# Altium project 28Pins_Project_v1I2.PrjPcb (part 1 of 3)
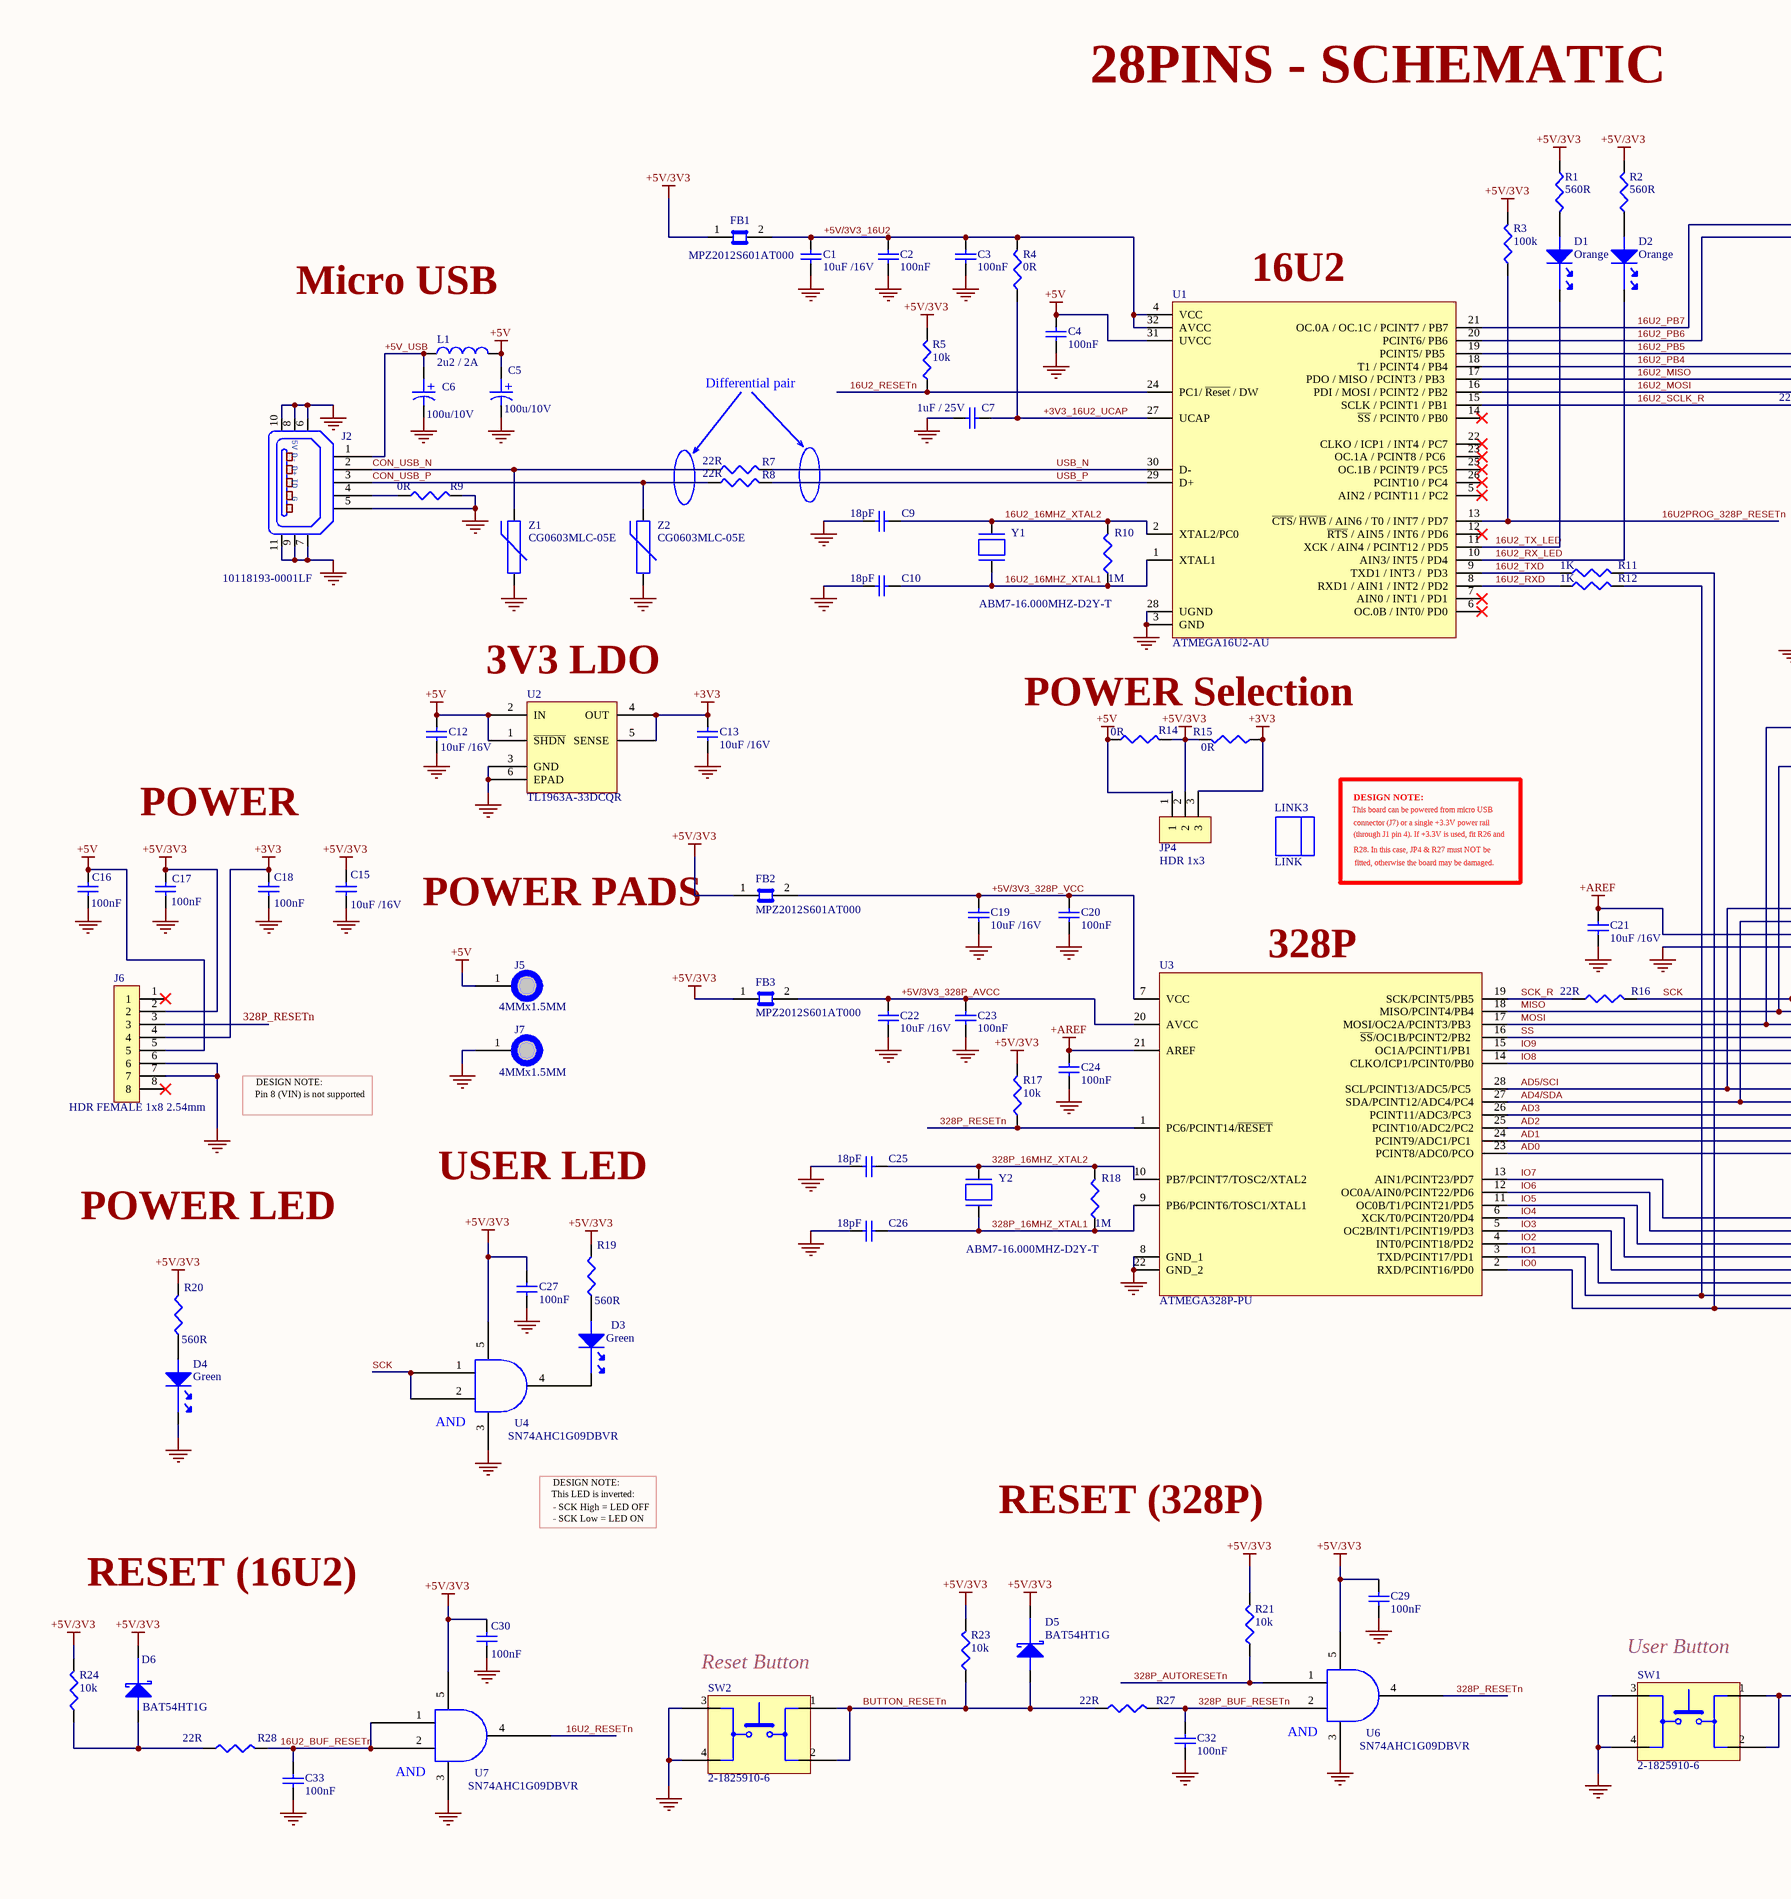
[diagram p0: 28Pins_Schem.SchDoc, left]
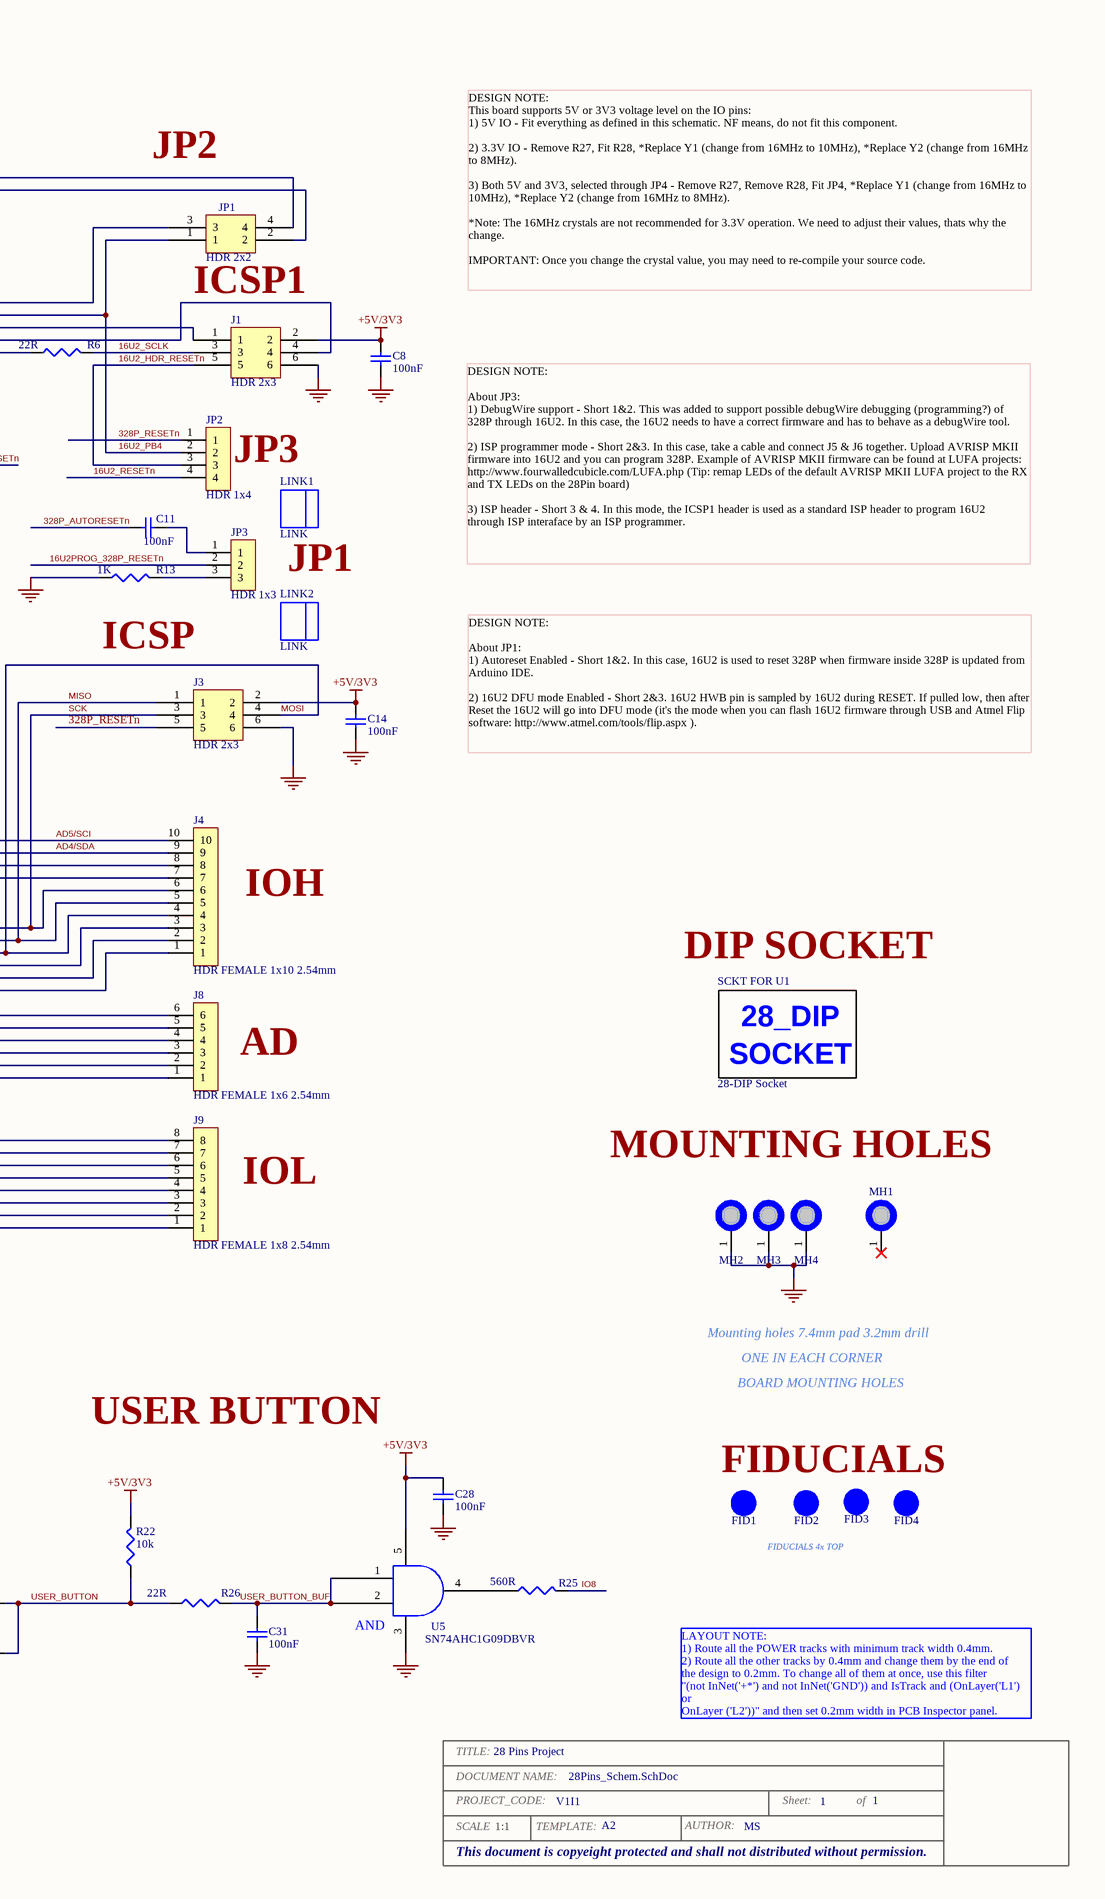
[diagram p1: 28Pins_Schem.SchDoc, right]
NotFitted: NF
1 sheet, 110 parts. Net scope: global (net labels, ports and power ports of the same name join across sheets).
Board file: 28Pins_Project_V1I1.PcbDoc

## Sheet 28Pins_Schem.SchDoc: 28 Pins Project
size A2; Author: MS; DocumentNumber: 1; Revision: V1I1; SheetNumber: 1; SheetTotal: 1

### Parts
28_Pins_Project  TEMPLATE: A2  (hidden comment: TitleBlock)  (graphical)
C1  10uF /16V  [C0805]
C2  100nF  [C0805]
C3  100nF  [C0805]
C4  100nF  [C0805]
C5  100u/10V  [C_ALU_C_SIZE]
C6  100u/10V  [C_ALU_C_SIZE]
C7  1uF / 25V  [C0805]
C8  100nF  [C0805]
C9  18pF  [C0805]
C10  18pF  [C0805]
C11  100nF  [C0805]
C12  10uF /16V  [C0805]
C13  10uF /16V  [C0805]
C14  100nF  [C0805]
C15  10uF /16V  [C0805]
C16  100nF  [C0805]
C17  100nF  [C0805]
C18  100nF  [C0805]
C19  10uF /16V  [C0805]
C20  100nF  [C0805]
C21  10uF /16V  [C0805]
C22  10uF /16V  [C0805]
C23  100nF  [C0805]
C24  100nF  [C0805]
C25  18pF  [C0805]
C26  18pF  [C0805]
C27  100nF  [C0805]
C28  100nF  [C0805]
C29  100nF  [C0805]
C30  100nF  [C0805]
C31  100nF  [C0805]
C32  100nF  [C0805]
C33  100nF  [C0805]
D1  Orange  [LED_0603]
D2  Orange  [LED_0603]
D3  Green  [LED_0603]
D4  Green  [LED_0603]
D5  BAT54HT1G  [SOD323]
D6  BAT54HT1G  [SOD323]
FB1  MPZ2012S601AT000  [C0805]
FB2  MPZ2012S601AT000  [C0805]
FB3  MPZ2012S601AT000  [C0805]
FID1  FID_1MMC  [FID_40X120]  (value not drawn)  (no BOM)
FID2  FID_1MMC  [FID_40X120]  (value not drawn)  (no BOM)
FID3  FID_1MMC  [FID_40X120]  (value not drawn)  (no BOM)
FID4  FID_1MMC  [FID_40X120]  (value not drawn)  (no BOM)
J1  HDR 2x3  [HDR_2x3_2.54MM]
J2  10118193-0001LF  [10118193]
J3  HDR 2x3  [HDR_2x3_2.54MM]
J4  HDR FEMALE 1x10 2.54mm  [Hdr_female_1x10_2.54mm]
J5  4MMx1.5MM  [PAD_WITH_HOLE_4MMx1.5MM]  (no BOM)
J6  HDR FEMALE 1x8 2.54mm  [Hdr_female_1x8_2.54mm]
J7  4MMx1.5MM  [PAD_WITH_HOLE_4MMx1.5MM]  (no BOM)
J8  HDR FEMALE 1x6 2.54mm  [Hdr_female_1x6_2.54mm]
J9  HDR FEMALE 1x8 2.54mm  [Hdr_female_1x8_2.54mm]
JP1  HDR 2x2  [HDR_2x2_2.54MM]
JP2  HDR 1x4  [Hdr_1x4_2.54mm]
JP3  HDR 1x3  [Hdr_1x3_2.54mm]
JP4  HDR 1x3  [Hdr_1x3_2.54mm]
L1  2u2 / 2A  [C1210_IND]
LINK1  LINK  (mechanical)
LINK2  LINK  (mechanical)
LINK3  LINK  (mechanical)
MH1  MH_7.4MMNC_3.2MMD  [MH_7.4MMD_3.2MMD_NON_COPPER_NPTH]  (value not drawn)  (no BOM)
MH2  MH_7.4MMC_3.2MMD  [MH_7.4MMD_3.2MMD]  (value not drawn)  (no BOM)
MH3  MH_7.4MMC_3.2MMD  [MH_7.4MMD_3.2MMD]  (value not drawn)  (no BOM)
MH4  MH_7.4MMC_3.2MMD  [MH_7.4MMD_3.2MMD]  (value not drawn)  (no BOM)
R1  560R  [R0805]
R2  560R  [R0805]
R3  100k  [R0805]
R4  0R  [R0805]
R5  10k  [R0805]
R6  22R  [R0805]
R7  22R  [R0805]
R8  22R  [R0805]
R9  0R  [R0805]
R10  1M  [R0805]
R11  1K  [R0805]
R12  1K  [R0805]
R13  1K  [R0805]
R14  0R  [R0805]
R15  0R  [R0805]
R16  22R  [R0805]
R17  10k  [R0805]
R18  1M  [R0805]
R19  560R  [R0805]
R20  560R  [R0805]
R21  10k  [R0805]
R22  10k  [R0805]
R23  10k  [R0805]
R24  10k  [R0805]
R25  560R  [R0805]
R26  22R  [R0805]
R27  22R  [R0805]
R28  22R  [R0805]
SCKT_FOR_U1  28-DIP Socket  [28_DIP_7.62mm_SOCKET]
SW1  2-1825910-6  [2-1825910-6]
SW2  2-1825910-6  [2-1825910-6]
U1  ATMEGA16U2-AU  [TQFP32]
U2  TL1963A-33DCQR  [DCQ (R-PDSO-G6)]
U3  ATMEGA328P-PU  [28_DIP_7.62MM]
U4  SN74AHC1G09DBVR  [DBV_SOT_23_5]
U5  SN74AHC1G09DBVR  [DBV_SOT_23_5]
U6  SN74AHC1G09DBVR  [DBV_SOT_23_5]
U7  SN74AHC1G09DBVR  [DBV_SOT_23_5]
Y1  ABM7-16.000MHZ-D2Y-T  [AMB7_V1_1_BIG]
Y2  ABM7-16.000MHZ-D2Y-T  [AMB7_V1_1_BIG]
Z1  CG0603MLC-05E  [R0603]
Z2  CG0603MLC-05E  [R0603]

### Nets
+3V3: C13.1 C18.1 J6.4 JP4.3 R15.1 U2.4(OUT) U2.5(SENSE)
+5V: C4.1 C5.1 C12.1 C16.1 J5.1 J6.5 JP4.1 L1.2 R14.1 U1.31(UVCC) U2.1(~{SHDN}) U2.2(IN)
+5V/3V3: C8.1 C14.1 C15.1 C17.1 C27.1 C28.1 C29.1 C30.1 D5.1(Cathode) D6.1(Cathode) FB1.1 FB2.1 FB3.1 J1.2 J3.2 J6.2 JP4.2 R1.1 R2.2 R3.2 R5.2 R14.2 R15.2 R17.2 R19.2 R20.2 R21.2 R22.2 R23.2 R24.2 U4.5 U5.5 U6.5 U7.5
+AREF: C21.1 C24.1 J4.8 U3.21(AREF)
GND: C1.2 C2.2 C3.2 C4.2 C5.2 C6.2 C7.1 C8.2 C9.1 C10.1 C12.2 C13.2 C14.2 C15.2 C16.2 C17.2 C18.2 C19.2 C20.2 C21.2 C22.2 C23.2 C24.2 C25.1 C26.1 C27.2 C28.2 C29.2 C30.2 C31.2 C32.2 C33.2 D4.1(Cathode) J1.6 J2.5 J2.6 J2.7 J2.8 J2.9 J2.10 J2.11 J3.6 J4.7 J6.6 J6.7 J7.1 MH2.1 MH3.1 MH4.1 R9.2 R13.1 SW1.3 SW1.4 SW2.3 SW2.4 U1.3(GND) U1.28(UGND) U2.3(GND) U2.6(EPAD) U3.8(GND_1) U3.22(GND_2) U4.3 U5.3 U6.3 U7.3 Z1.1 Z2.1
16U2_16MHZ_XTAL1: C10.2 R10.1 U1.1(XTAL1) Y1.1
16U2_16MHZ_XTAL2: C9.2 R10.2 U1.2(XTAL2/PC0) Y1.2
16U2_BUF_RESETn: C33.1 R28.2 U7.1 U7.2
16U2_HDR_RESETn: J1.5 JP2.3
16U2_MISO: J1.1 U1.17(PDO_/_MISO_/_PCINT3_/_PB3)
16U2_MOSI: J1.4 U1.16(PDI_/_MOSI_/_PCINT2_/_PB2)
16U2_PB4: JP1.1 JP2.2 U1.18(T1_/_PCINT4_/_PB4)
16U2_PB5: JP1.3 U1.19(PCINT5/_PB5)
16U2_PB6: JP1.2 U1.20(PCINT6/_PB6)
16U2_PB7: JP1.4 U1.21(OC.0A_/_OC.1C_/_PCINT7_/_PB7)
16U2_RESETn: JP2.4 R5.1 U1.24(PC1/_~{Reset}_/_DW) U7.4
16U2_RX_LED: D2.1(Cathode) U1.10(AIN3/_INT5_/_PD4)
16U2_RXD: R12.1 U1.8(RXD1_/_AIN1_/_INT2_/_PD2)
16U2_SCLK: J1.3 R6.2
16U2_SCLK_R: R6.1 U1.15(SCLK_/_PCINT1_/_PB1)
16U2_TX_LED: D1.1(Cathode) U1.11(XCK_/_AIN4_/_PCINT12_/_PD5)
16U2_TXD: R11.1 U1.9(TXD1_/_INT3_/__PD3)
16U2PROG_328P_RESETn: JP3.2 R3.1 U1.13(~{CTS}/_~{HWB}_/_AIN6_/_T0_/_INT7_/_PD7)
328P_16MHZ_XTAL1: C26.2 R18.1 U3.9(PB6/PCINT6/TOSC1/XTAL1) Y2.1
328P_16MHZ_XTAL2: C25.2 R18.2 U3.10(PB7/PCINT7/TOSC2/XTAL2) Y2.2
328P_AUTORESETn: C11.2 R21.1 U6.1
328P_BUF_RESETn: C32.1 R27.2 U6.2
328P_RESETn: J3.5 J6.3 JP2.1 R17.1 U3.1(PC6/PCINT14/~{RESET}) U6.4
+3V3_16U2_UCAP: C7.2 R4.1 U1.27(UCAP)
+5V/3V3_16U2: C1.1 C2.1 C3.1 FB1.2 R4.2 U1.4(VCC) U1.32(AVCC)
+5V/3V3_328P_AVCC: C22.1 C23.1 FB3.2 U3.20(AVCC)
+5V/3V3_328P_VCC: C19.1 C20.1 FB2.2 U3.7(VCC)
+5V_USB: C6.1 J2.1 L1.1
AD0: J8.1 U3.23(PCINT8/ADC0/PCO)
AD1: J8.2 U3.24(PCINT9/ADC1/PC1)
AD2: J8.3 U3.25(PCINT10/ADC2/PC2)
AD3: J8.4 U3.26(PCINT11/ADC3/PC3)
AD4/SDA: J4.9 J8.5 U3.27(SDA/PCINT12/ADC4/PC4)
AD5/SCI: J4.10 J8.6 U3.28(SCL/PCINT13/ADC5/PC5)
BUTTON_RESETn: D5.2(Anode) R23.1 R27.1 SW2.1 SW2.2
CON_USB_N: J2.2 R7.1 Z1.2
CON_USB_P: J2.3 R8.1 Z2.2
IO0: J9.1 R11.2 U3.2(RXD/PCINT16/PD0)
IO1: J9.2 R12.2 U3.3(TXD/PCINT17/PD1)
IO2: J9.3 U3.4(INT0/PCINT18/PD2)
IO3: J9.4 U3.5(OC2B/INT1/PCINT19/PD3)
IO4: J9.5 U3.6(XCK/T0/PCINT20/PD4)
IO5: J9.6 U3.11(OC0B/T1/PCINT21/PD5)
IO6: J9.7 U3.12(OC0A/AIN0/PCINT22/PD6)
IO7: J9.8 U3.13(AIN1/PCINT23/PD7)
IO8: J4.1 R25.2 U3.14(CLKO/ICP1/PCINT0/PB0)
IO9: J4.2 U3.15(OC1A/PCINT1/PB1)
MISO: J3.1 J4.5 U3.18(MISO/PCINT4/PB4)
MOSI: J3.4 J4.4 U3.17(MOSI/OC2A/PCINT3/PB3)
SCK: J3.3 J4.6 R16.2 U4.1 U4.2
SCK_R: R16.1 U3.19(SCK/PCINT5/PB5)
SS: J4.3 U3.16(~{SS}/OC1B/PCINT2/PB2)
USB_N: R7.2 U1.30(D-)
USB_P: R8.2 U1.29(D+)
USER_BUTTON: R22.1 R26.1 SW1.1 SW1.2
USER_BUTTON_BUF: C31.1 R26.2 U5.1 U5.2
NetC11_1: C11.1 JP3.1
NetD1_2: D1.2(Anode) R1.2
NetD2_2: D2.2(Anode) R2.1
NetD3_1: D3.1(Cathode) U4.4
NetD3_2: D3.2(Anode) R19.1
NetD4_2: D4.2(Anode) R20.1
NetD6_2: D6.2(Anode) R24.1 R28.1
NetJ2_4: J2.4 R9.1
NetJP3_3: JP3.3 R13.2
NetR25_1: R25.1 U5.4

Not connected (* = marked no-connect by the designer): J6 1* 8*; MH1 1*; U1 5(AIN2_/_PCINT11_/_PC2)* 6(OC.0B_/_INT0/_PD0)* 7(AIN0_/_INT1_/_PD1)* 12(~{RTS}_/_AIN5_/_INT6_/_PD6)* 14(~{SS}_/_PCINT0_/_PB0)* 22(CLKO_/_ICP1_/_INT4_/_PC7)* 23(OC.1A_/_PCINT8_/_PC6_)* 25(OC.1B_/_PCINT9_/_PC5)* 26(PCINT10_/_PC4)*

### Notes on the sheet
- 28PINS - SCHEMATIC
- JP2
- (near U1) 16U2
- Micro USB
- (near JP1) ICSP1
- DESIGN NOTE:
  This board supports 5V or 3V3 voltage level on the IO pins:
  1) 5V IO - Fit everything as defined in this schematic. NF means, do not fit this component.
  2) 3.3V IO - Remove R27, Fit R28, *Replace Y1 (change from 16MHz to 10MHz), *Replace Y2 (change from 16MHz
  to 8MHz).
  3) Both 5V and 3V3, selected through JP4 - Remove R27, Remove R28, Fit JP4, *Replace Y1 (change from 16MHz to
  10MHz), *Replace Y2 (change from 16MHz to 8MHz).
  *Note: The 16MHz crystals are not recommended for 3.3V operation. We need to adjust their values, thats why the
  change.
  IMPORTANT: Once you change the crystal value, you may need to re-compile your source code.
- Differential pair
- JP3
- JP1
- DESIGN NOTE:
  About JP3:
  1) DebugWire support - Short 1&2. This was added to support possible debugWire debugging (programming?) of
  328P through 16U2. In this case, the 16U2 needs to have a correct firmware and has to behave as a debugWire tool.
  2) ISP programmer mode - Short 2&3. In this case, take a cable and connect J5 & J6 together. Upload AVRISP MKII
  firmware into 16U2 and you can program 328P. Example of AVRISP MKII firmware can be found at LUFA projects:
  http://www.fourwalledcubicle.com/LUFA.php (Tip: remap LEDs of the default AVRISP MKII LUFA project to the RX
  and TX LEDs on the 28Pin board)
  3) ISP header - Short 3 & 4. In this mode, the ICSP1 header is used as a standard ISP header to program 16U2
  through ISP interaface by an ISP programmer.
- (near U2) 3V3 LDO
- POWER Selection
- ICSP
- DESIGN NOTE:
- POWER
- This board can be powered from micro USB
- connector (J7) or a single +3.3V power rail
- (through J1 pin 4). If +3.3V is used, fit R26 and
- R28. In this case, JP4 & R27 must NOT be
- fitted, otherwise the board may be damaged.
- DESIGN NOTE:
  About JP1:
  1) Autoreset Enabled - Short 1&2. In this case, 16U2 is used to reset 328P when firmware inside 328P is updated from
  Arduino IDE.
  2) 16U2 DFU mode Enabled - Short 2&3. 16U2 HWB pin is sampled by 16U2 during RESET. If pulled low, then after
  Reset the 16U2 will go into DFU mode (it's the mode when you can flash 16U2 firmware through USB and Atmel Flip
  software: http://www.atmel.com/tools/flip.aspx ).
- POWER PADS
- (near U3) 328P
- IOH
- DIP SOCKET
- Pin 8 (VIN) is not supported
- USER LED
- (near J8) AD
- POWER LED
- MOUNTING HOLES
- (near J9) IOL
- Mounting holes 7.4mm pad 3.2mm drill
- ONE IN EACH CORNER
- This LED is inverted:
- - SCK High = LED OFF
- USER BUTTON
- BOARD MOUNTING HOLES
- - SCK Low = LED ON
- RESET (328P)
- FIDUCIALS
- RESET (16U2)
- FIDUCIALS 4x TOP
- (near SW2) Reset Button
- (near SW1) User Button
- LAYOUT NOTE:
  1) Route all the POWER tracks with minimum track width 0.4mm.
  2) Route all the other tracks by 0.4mm and change them by the end of
  the design to 0.2mm. To change all of them at once, use this filter
  "(not InNet('+*') and not InNet('GND')) and IsTrack and (OnLayer('L1') or
  OnLayer ('L2'))" and then set 0.2mm width in PCB Inspector panel.
- (in symbol 4828-3004-CP) 28_DIP; SOCKET
- (in symbol 10118193-0001LF) 5V; D-; D+; ID; G
- (in symbol EEE-1AA101WR) +
- (in symbol SN74AHC1G09DBVR) AND
- (in symbol TitleBlock) TITLE:; DOCUMENT NAME:; PROJECT_CODE:; Sheet:; of; SCALE; 1:1; TEMPLATE:; AUTHOR:; This document is copyeight protected and shall not distributed without permission.